# EAGLE design ir5 (EAGLE 5.10)
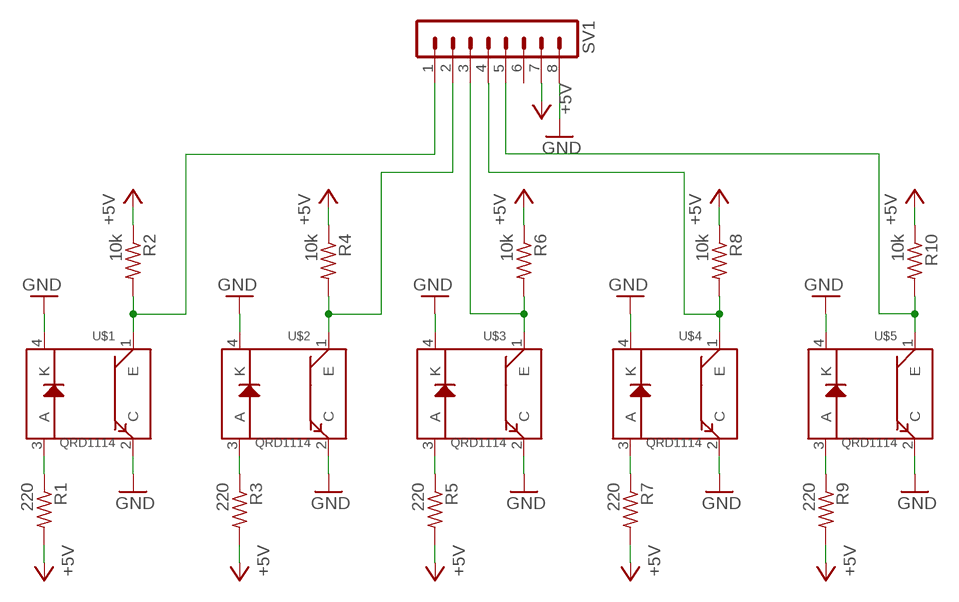
[diagram p0: schematic, sheet 1]

## Parts
R1  220  R-US_0204/7  [0204/7]
R2  10k  R-US_0204/7  [0204/7]
R3  220  R-US_0204/7  [0204/7]
R4  10k  R-US_0204/7  [0204/7]
R5  220  R-US_0204/7  [0204/7]
R6  10k  R-US_0204/7  [0204/7]
R7  220  R-US_0204/7  [0204/7]
R8  10k  R-US_0204/7  [0204/7]
R9  220  R-US_0204/7  [0204/7]
R10  10k  R-US_0204/7  [0204/7]
SV1  MA08-1W  [MA08-1W]
U$1  QRD1114  [QRD1114]
U$2  QRD1114  [QRD1114]
U$3  QRD1114  [QRD1114]
U$4  QRD1114  [QRD1114]
U$5  QRD1114  [QRD1114]

## Nets
+5V: R1.2 R2.1 R3.2 R4.1 R5.2 R6.1 R7.2 R8.1 R9.2 R10.1 SV1.7
GND: SV1.8 U$1.2(C) U$1.4(K) U$2.2(C) U$2.4(K) U$3.2(C) U$3.4(K) U$4.2(C) U$4.4(K) U$5.2(C) U$5.4(K)
N$1: R1.1 U$1.3(A)
N$2: R2.2 SV1.1 U$1.1(E)
N$3: R3.1 U$2.3(A)
N$4: R5.1 U$3.3(A)
N$5: R7.1 U$4.3(A)
N$6: R4.2 SV1.2 U$2.1(E)
N$7: R9.1 U$5.3(A)
N$10: R6.2 SV1.3 U$3.1(E)
N$14: R8.2 SV1.4 U$4.1(E)
N$18: R10.2 SV1.5 U$5.1(E)
Unconnected: SV1.6

## Library data of the parts
R1-R10 = resistor:R-US_: RESISTOR, American symbol
SV1 = con-lstb:MA08-1W: PIN HEADER
U$1-U$5 = SparkFun:QRD1114

## Board
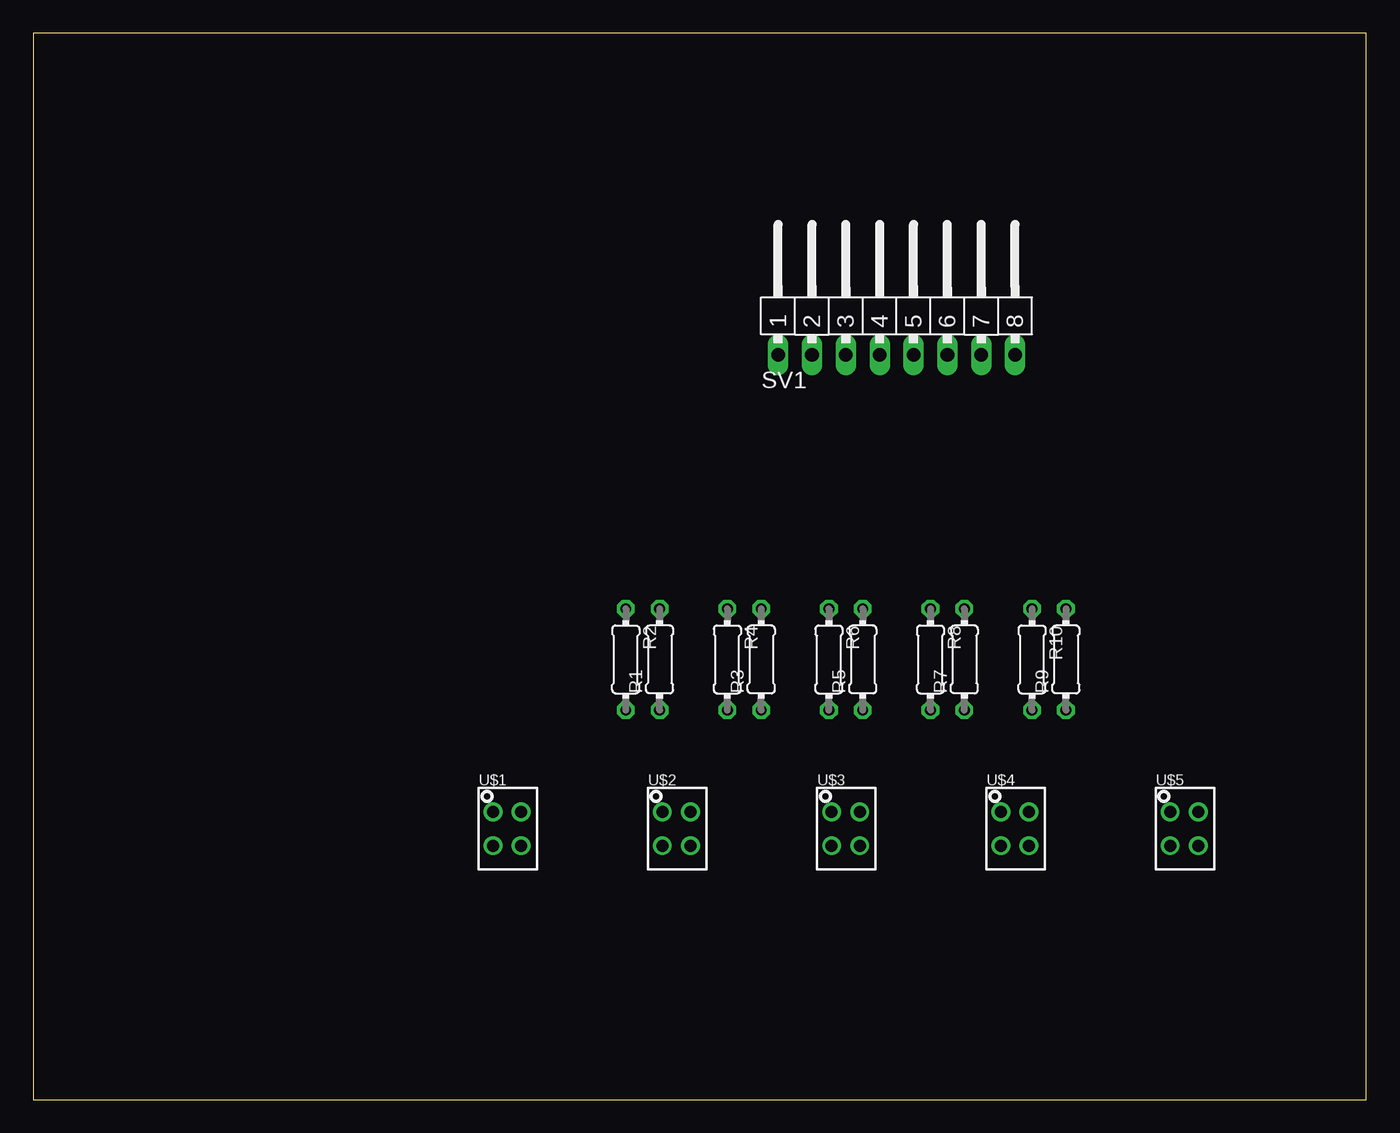
[diagram p1: board, top side]
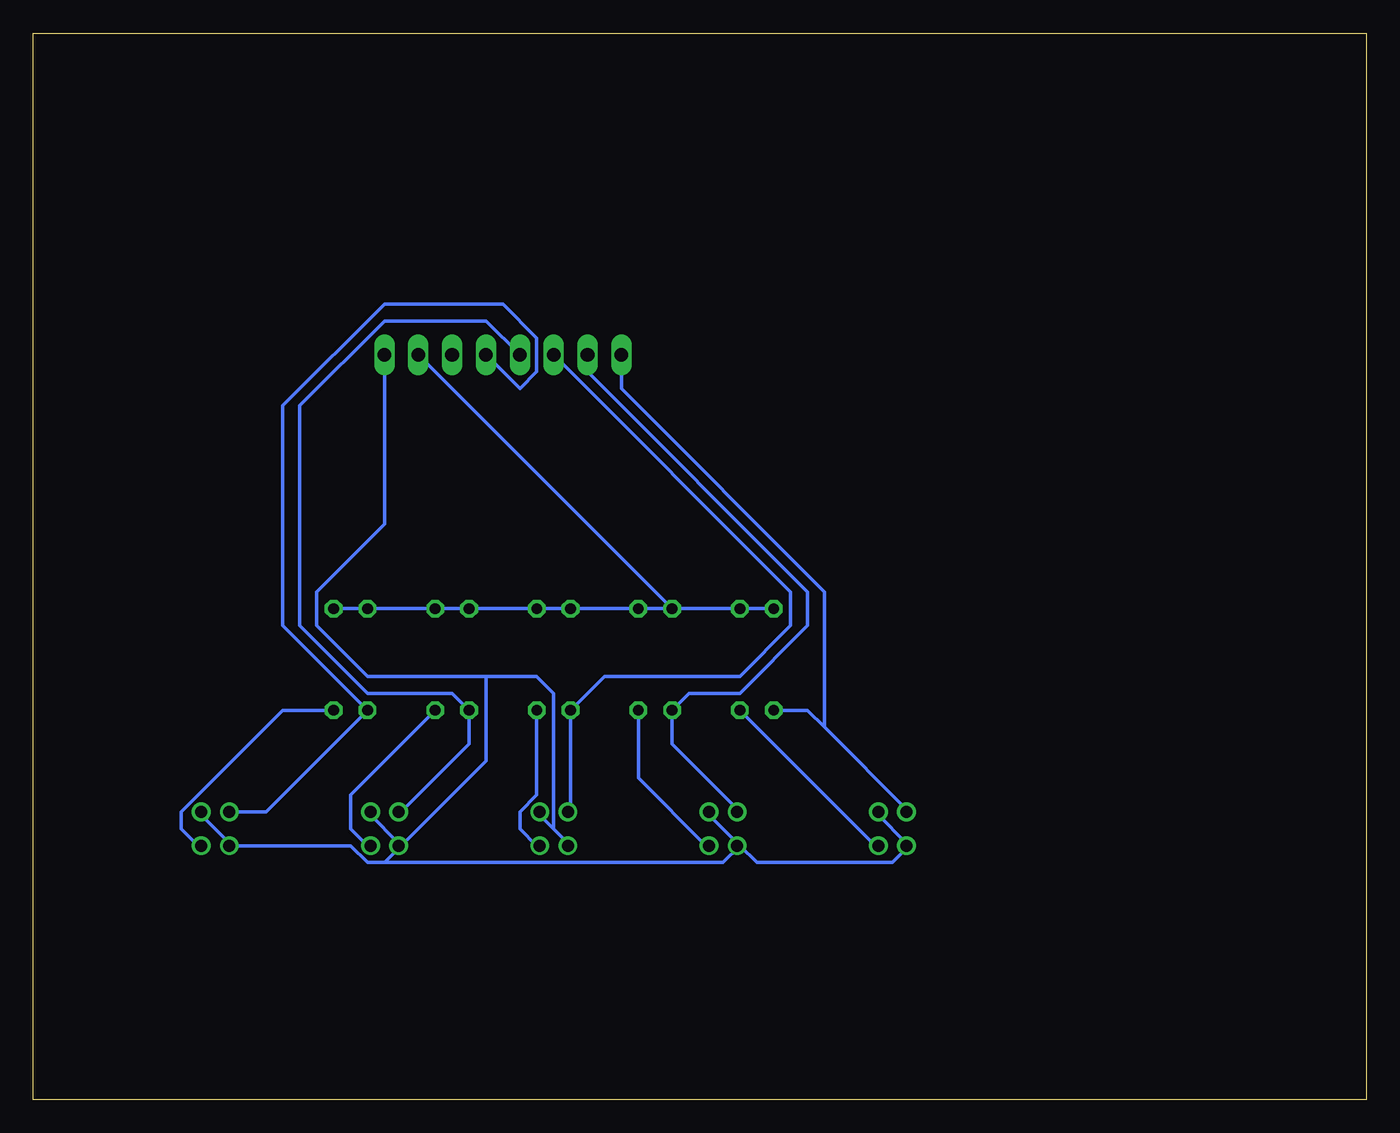
[diagram p2: board, bottom side, seen from below]

Size 100 x 80 mm. Coordinates in mm from the lower left corner, seen from the top.
Outline: 0,0 100,0 100,80 0,80 0,0
Copper layers (1*16): Top 0.035mm / dielectric 1.5mm / Bottom 0.035mm
Design rules "default": minimum track width 10mil, minimum drill 24mil, track to track 8mil, track to pad 8mil, pad to pad 8mil, via to via 8mil, smd to smd 8mil, copper to edge 40mil, drill to drill 8mil, minimum pad ring 10mil, minimum via ring 8mil, stop-mask expansion 4mil, vias tented up to drill 0mil, thermal gap 10mil

### Footprints (pad centres in the part's own frame; a part is rotated, then mirrored left to right if it is on the bottom)
0204/7 = drill 0.813 octagon: 1 -3.81,0; 2 3.81,0
MA08-1W = drill 1.016 long: 1 -8.89,0; 2 -6.35,0; 3 -3.81,0; 4 -1.27,0; 5 1.27,0; 6 3.81,0; 7 6.35,0; 8 8.89,0
QRD1114 = drill 0.9 round: 1 -1.067,1.27; 2 -1.067,-1.27; 3 1.041,-1.27; 4 1.041,1.27

### Placement (x,y rotation side)
R1  46.99,33.02 90 top
R2  44.45,33.02 270 top
R3  54.61,33.02 90 top
R4  52.07,33.02 270 top
R5  62.23,33.02 90 top
R6  59.69,33.02 270 top
R7  69.85,33.02 90 top
R8  67.31,33.02 270 top
R9  77.47,33.02 90 top
R10  74.93,33.02 270 top
SV1  64.77,55.88 0 top
U$1  35.56,20.32 0 top
U$2  48.26,20.32 0 top
U$3  60.96,20.32 0 top
U$4  73.66,20.32 0 top
U$5  86.36,20.32 0 top

### Tracks (layer width: path | path; a pad name or v marks a point on that pad's centre or on a via)
+5V
  Bottom 0.254: R9.2 R10.1 R7.2 R8.1 R5.2 R6.1 R3.2 R4.1 | R2.1 R1.2 R4.1 | R4.1 SV1.7
GND
  Bottom 0.254: 34.29,19.05 36.83,21.59 U$1.4 | 46.99,19.05 49.53,21.59 U$2.4 | 34.29,19.05 35.56,17.78 45.72,17.78 46.99,19.05 | U$1.2 34.29,19.05 | 85.09,19.05 87.63,21.59 U$5.4 | 72.39,19.05 74.93,21.59 U$4.4 | 60.96,20.32 62.23,21.59 U$3.4 | 60.96,20.32 59.69,19.05 U$3.2 | SV1.8 73.66,43.18 78.74,38.1 78.74,35.56 74.93,31.75 66.04,31.75 | 66.04,31.75 62.23,31.75 60.96,30.48 60.96,20.32 | 72.39,19.05 66.04,25.4 66.04,31.75 | 85.09,19.05 76.2,19.05 74.93,17.78 73.66,17.78 | 73.66,17.78 72.39,19.05 | 85.09,19.05 U$5.2 | 72.39,19.05 U$4.2 | 46.99,19.05 48.26,17.78 73.66,17.78 | 46.99,19.05 U$2.2
N$1
  Bottom 0.254: R1.1 36.83,19.05 U$1.3
N$2
  Bottom 0.254: R2.2 41.91,29.21 40.64,27.94 | 40.64,27.94 34.29,21.59 U$1.1 | SV1.1 55.88,53.34 40.64,38.1 40.64,27.94
N$3
  Bottom 0.254: R3.1 54.61,24.13 49.53,19.05 U$2.3
N$4
  Bottom 0.254: R5.1 62.23,22.86 63.5,21.59 63.5,20.32 62.23,19.05 U$3.3
N$5
  Bottom 0.254: R7.1 76.2,22.86 76.2,20.32 74.93,19.05 U$4.3
N$6
  Bottom 0.254: U$2.1 46.99,21.59 52.07,26.67 R4.2 50.8,30.48 46.99,30.48 41.91,35.56 41.91,38.1 58.42,54.61 SV1.2
N$7
  Bottom 0.254: R9.1 81.28,29.21 88.9,21.59 88.9,20.32 87.63,19.05 U$5.3
N$10
  Bottom 0.254: U$3.1 59.69,21.59 R6.2 57.15,31.75 46.99,31.75 43.18,35.56 43.18,38.1 SV1.3
N$14
  Bottom 0.254: U$4.1 72.39,21.59 67.31,26.67 R8.2 68.58,30.48 74.93,30.48 80.01,35.56 80.01,52.07 73.66,58.42 66.04,58.42 SV1.4
N$18
  Bottom 0.254: U$5.1 85.09,21.59 82.55,21.59 R10.2 81.28,35.56 81.28,52.07 73.66,59.69 64.77,59.69 62.23,57.15 62.23,54.61 63.5,53.34 SV1.5